# Altium project Tray 3.PrjPcb
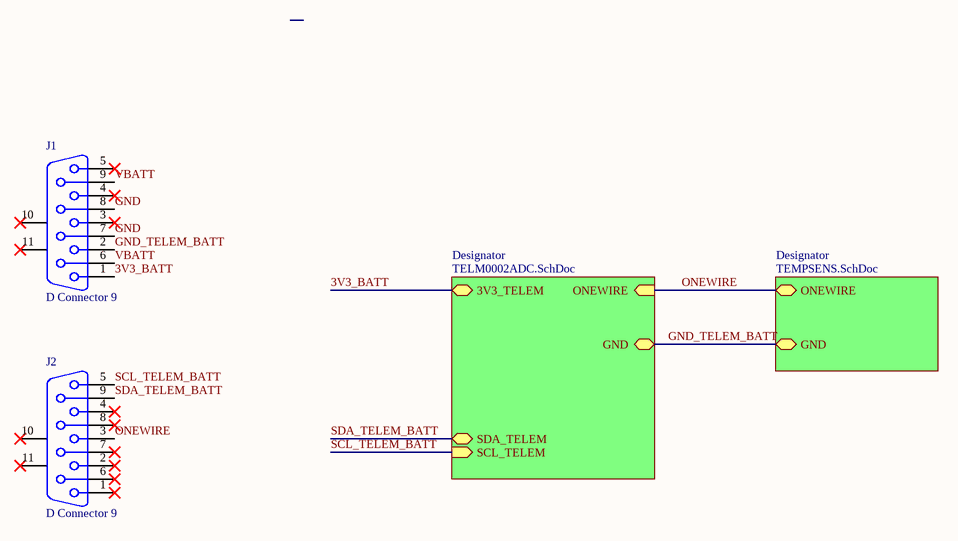
[diagram p0: Tray3.SchDoc]
3 sheets, 13 parts. Net scope: hierarchical (ports join the sheet entries above them; power ports are global).
Board file: Tray3.PcbDoc
Sheets:
  Tray3.SchDoc
    Designator = TELM0002ADC.SchDoc
    Designator = TEMPSENS.SchDoc

## Sheet Tray3.SchDoc
size A4

### Parts
J1  D Connector 9  [DSUB1.385-2H9]
J2  D Connector 9  [DSUB1.385-2H9]

### Sub-sheets
Designator = TELM0002ADC.SchDoc: 3V3_TELEM, SDA_TELEM (bidir), ONEWIRE (in), GND, SCL_TELEM (in)
Designator = TEMPSENS.SchDoc: ONEWIRE (bidir), GND

### Nets
3V3_BATT: J1.1 ; sheet Designator/3V3_TELEM
GND_TELEM_BATT: J1.2 ; sheet Designator/GND, sheet Designator/GND
GND: J1.7 J1.8
ONEWIRE: J2.3 ; sheet Designator/ONEWIRE, sheet Designator/ONEWIRE
SCL_TELEM_BATT: J2.5 ; sheet Designator/SCL_TELEM
SDA_TELEM_BATT: J2.9 ; sheet Designator/SDA_TELEM
VBATT: J1.6 J1.9

Not connected (* = marked no-connect by the designer): J1 3* 4* 5* 10(MH1)* 11(MH2)*; J2 1* 2* 4* 6* 7* 8* 10(MH1)* 11(MH2)*

### Library data of the parts
J1 J2 = D Connector 9: Receptacle Assembly, 9 Position, Right Angle; PackageDocument: O; Positions: 9; Published: 15-Jun-2001; LatestRevisionDate: 17-Jul-2002; LatestRevisionNote: Re-released for DXP Platform.; DatasheetDocument: 1-Sep-1999; PackageReference: 788750; Publisher: Altium Limited; Orientation: Right Angle; Gender: Receptacle

## Sheet TELM0002ADC.SchDoc: MAX127 Telemetry Circuit
size A3; Engineer: A. SHAW; Organization: BLUEsat Project; Address1: Room 419; Address2: School of EE&T; Address3: UNSW, NSW 2052; Address4: Australia; DocumentNumber: TELM0002; SheetNumber: 1; SheetTotal: 1; Description: Telemetry ADC Circuit; Version: 1.0
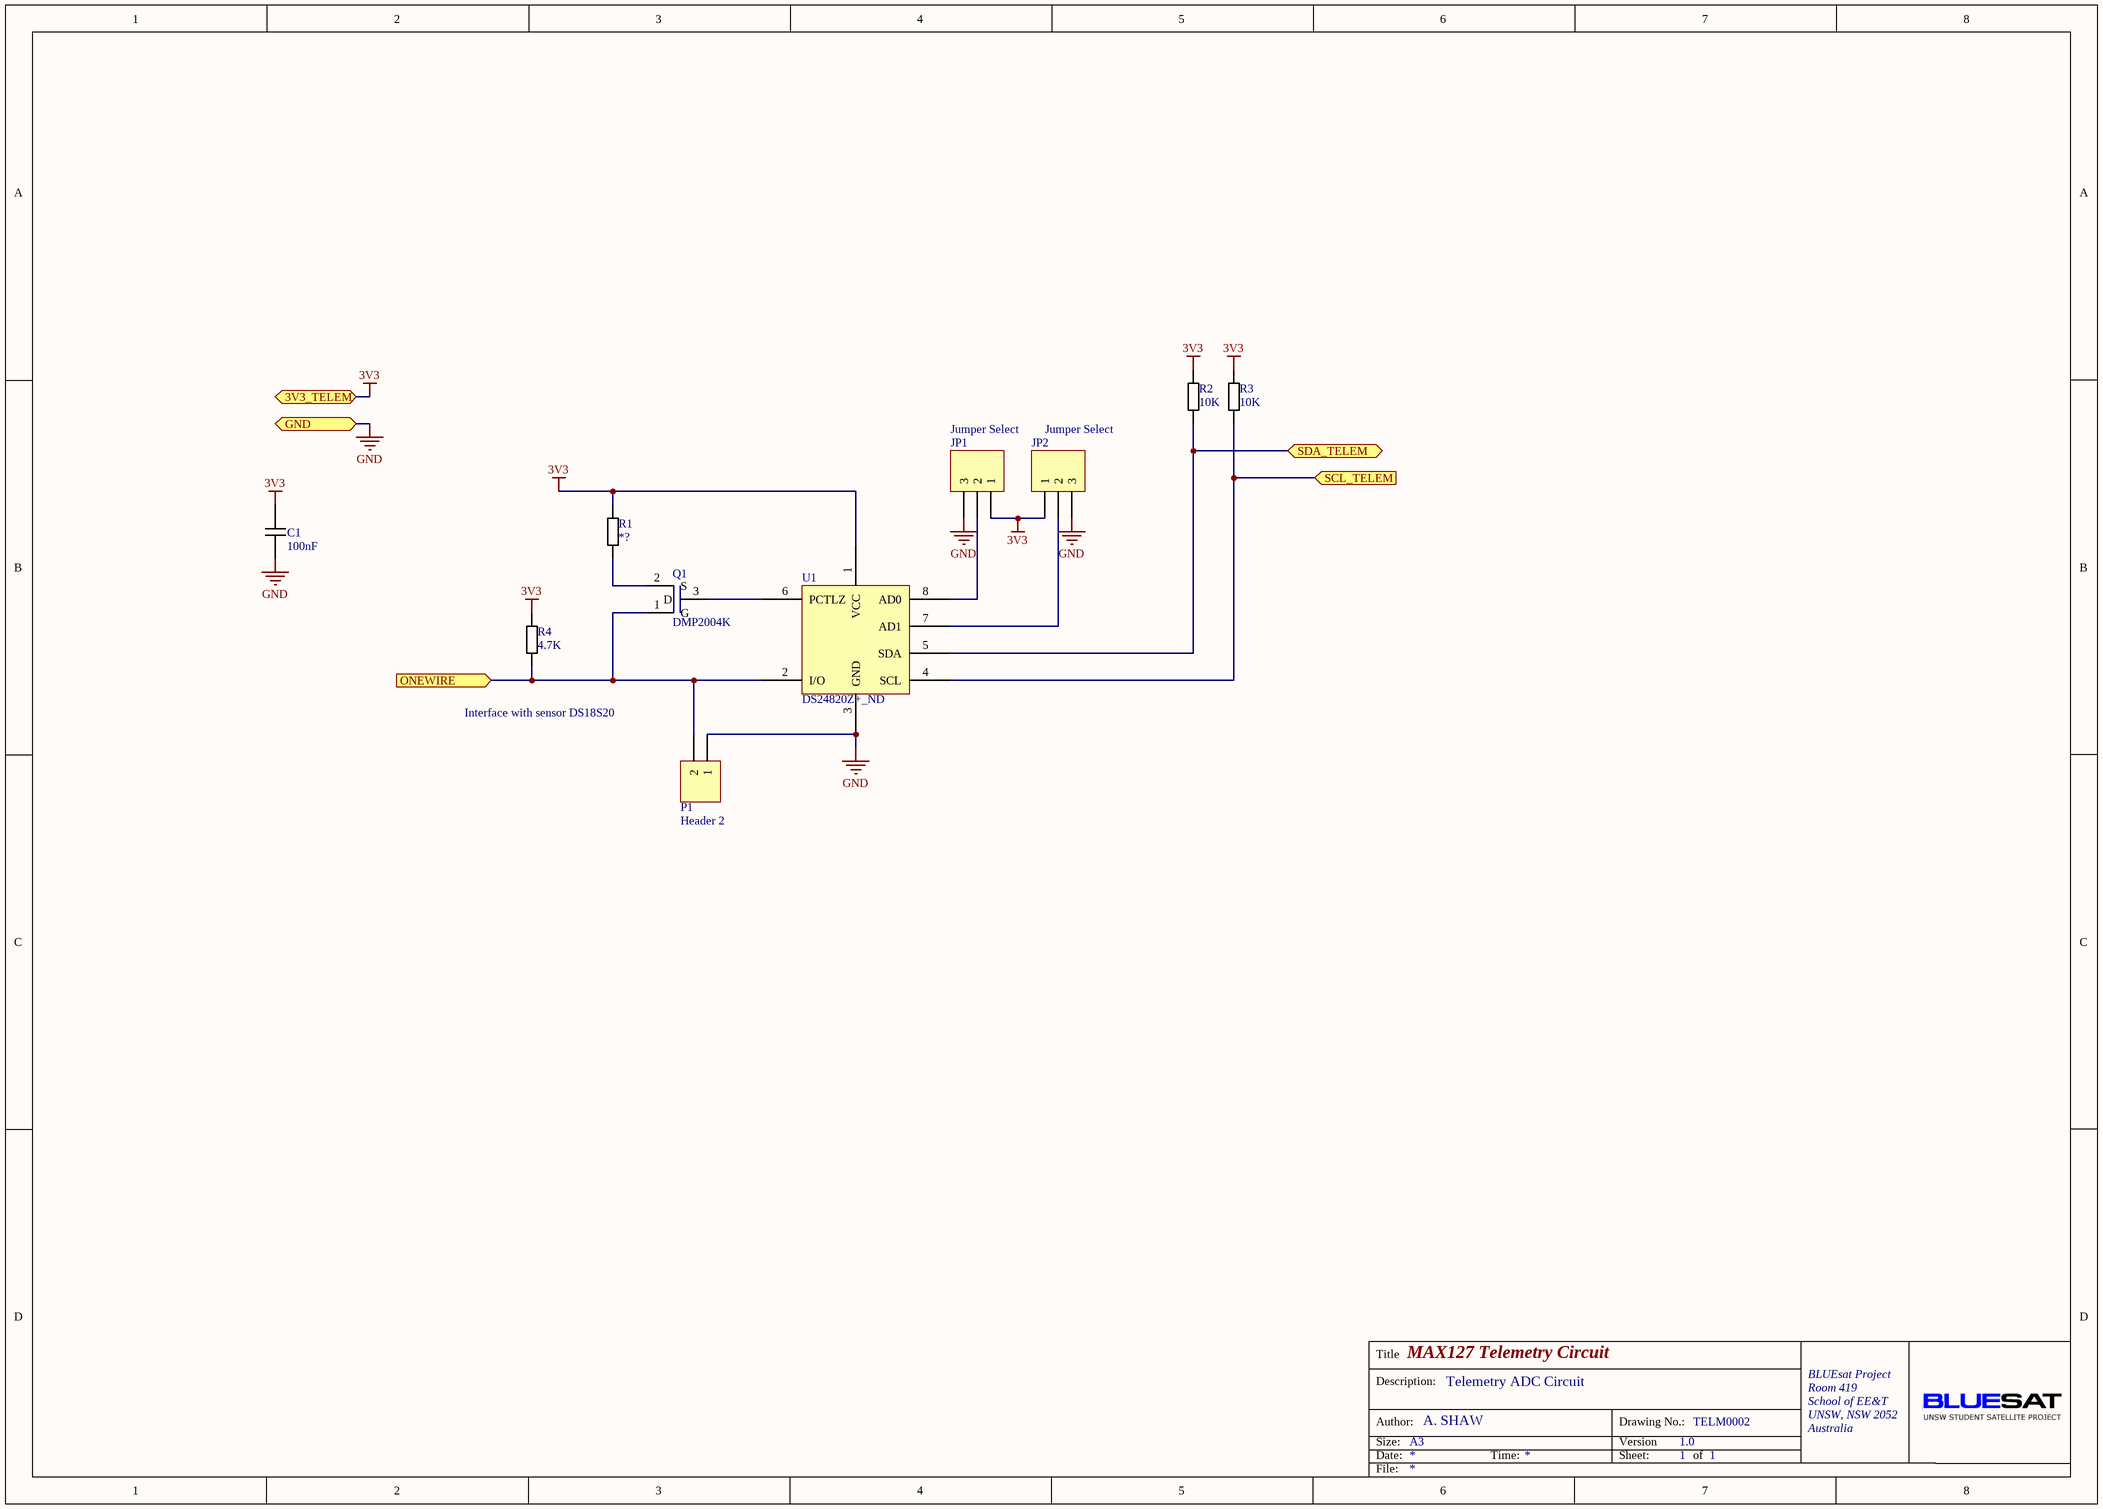
[diagram p1: TELM0002ADC.SchDoc]

### Parts
C1  value 100nF  [0805 Cap]  (hidden comment: 0805 Cap)
JP1  Jumper Select  [SOLDER_JUMPER_3_A]
JP2  Jumper Select  [SOLDER_JUMPER_3_A]
P1  Header 2  [HDR1X2]
Q1  DMP2004K  [DMP2004KDITR-ND]
R1  value *?  [0805 Resistor]  (hidden comment: 0805 Resistor)
R2  value 10K  [0805 Resistor]  (hidden comment: 0805 Resistor)
R3  value 10K  [0805 Resistor]  (hidden comment: 0805 Resistor)
R4  value 4.7K  [0805 Resistor]  (hidden comment: 0603 Resistor)
U1  DS24820Z+_ND  [DS2482-100]

### Ports
3V3_TELEM, GND, ONEWIRE (in), SCL_TELEM (in), SDA_TELEM (bidir)

### Nets
3V3: C1.2 JP1.1 JP2.1 R1.2 R2.2 R3.2 R4.2 U1.1(VCC) ; port 3V3_TELEM  [project net 3V3_BATT]
GND: C1.1 JP1.3 JP2.3 P1.1 U1.3(GND) ; port GND  [project net GND_TELEM_BATT]
ONEWIRE: P1.2 Q1.1(G) R4.1 U1.2(I/O) ; port ONEWIRE
SCL_TELEM_BATT: R3.1 U1.4(SCL) ; port SCL_TELEM
SDA_TELEM_BATT: R2.1 U1.5(SDA) ; port SDA_TELEM
NetJP1_2: JP1.2 U1.8(AD0)
NetJP2_2: JP2.2 U1.7(AD1)
NetQ1_2: Q1.2(S) R1.1
NetQ1_3: Q1.3(D) U1.6(PCTLZ)

### Notes on the sheet
- Interface with sensor DS18S20
- Title
- Description:
- Size:
- Author:
- Date:
- A3
- Time:
- Version
- Sheet:
- Drawing No.:
- of
- File:

### Library data of the parts
C1 = 0805 MLCC - X7R, 10%
JP1 JP2 = Header 3: Header, 3-Pin; LatestRevisionDate: 17-Jul-2002; LatestRevisionNote: Re-released for DXP Platform.; Publisher: Altium Limited
P1 = Header 2: Header, 2-Pin; LatestRevisionDate: 17-Jul-2002; LatestRevisionNote: Re-released for DXP Platform.; Publisher: Altium Limited
Q1 = DMP2004K: MOSFET P-CH 20V 600MA SOT23-3
R1-R3 = 0805 Thick Film Resistor 1%
R4 = 0603 Thick Film Resistor 1%

## Sheet TEMPSENS.SchDoc
size A4
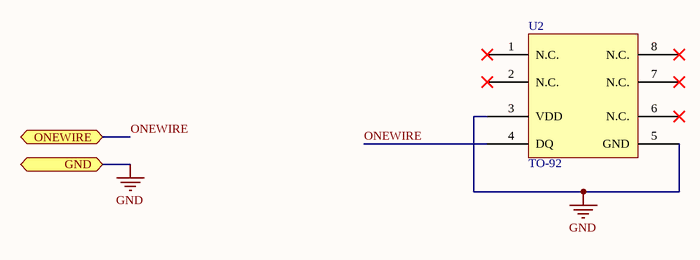
[diagram p2: TEMPSENS.SchDoc]

### Parts
U2  TO-92  [DS18S20]

### Ports
GND, ONEWIRE (bidir)

### Nets
GND: U2.3(VDD) U2.5(GND) ; port GND  [project net GND_TELEM_BATT]
ONEWIRE: U2.4(DQ) ; port ONEWIRE

Not connected (* = marked no-connect by the designer): U2 1(N.C.)* 2(N.C.)* 6(N.C.)* 7(N.C.)* 8(N.C.)*

### Library data of the parts
U2 = DS18S20

## Nets that join several sheets
3V3_BATT: Tray3 (J1.1), TELM0002ADC (8 pins)
GND_TELEM_BATT: Tray3 (J1.2), TELM0002ADC (5 pins), TEMPSENS (U2.3 U2.5)
ONEWIRE: Tray3 (J2.3), TELM0002ADC (P1.2 Q1.1 R4.1 U1.2), TEMPSENS (U2.4)
SCL_TELEM_BATT: Tray3 (J2.5), TELM0002ADC (R3.1 U1.4)
SDA_TELEM_BATT: Tray3 (J2.9), TELM0002ADC (R2.1 U1.5)